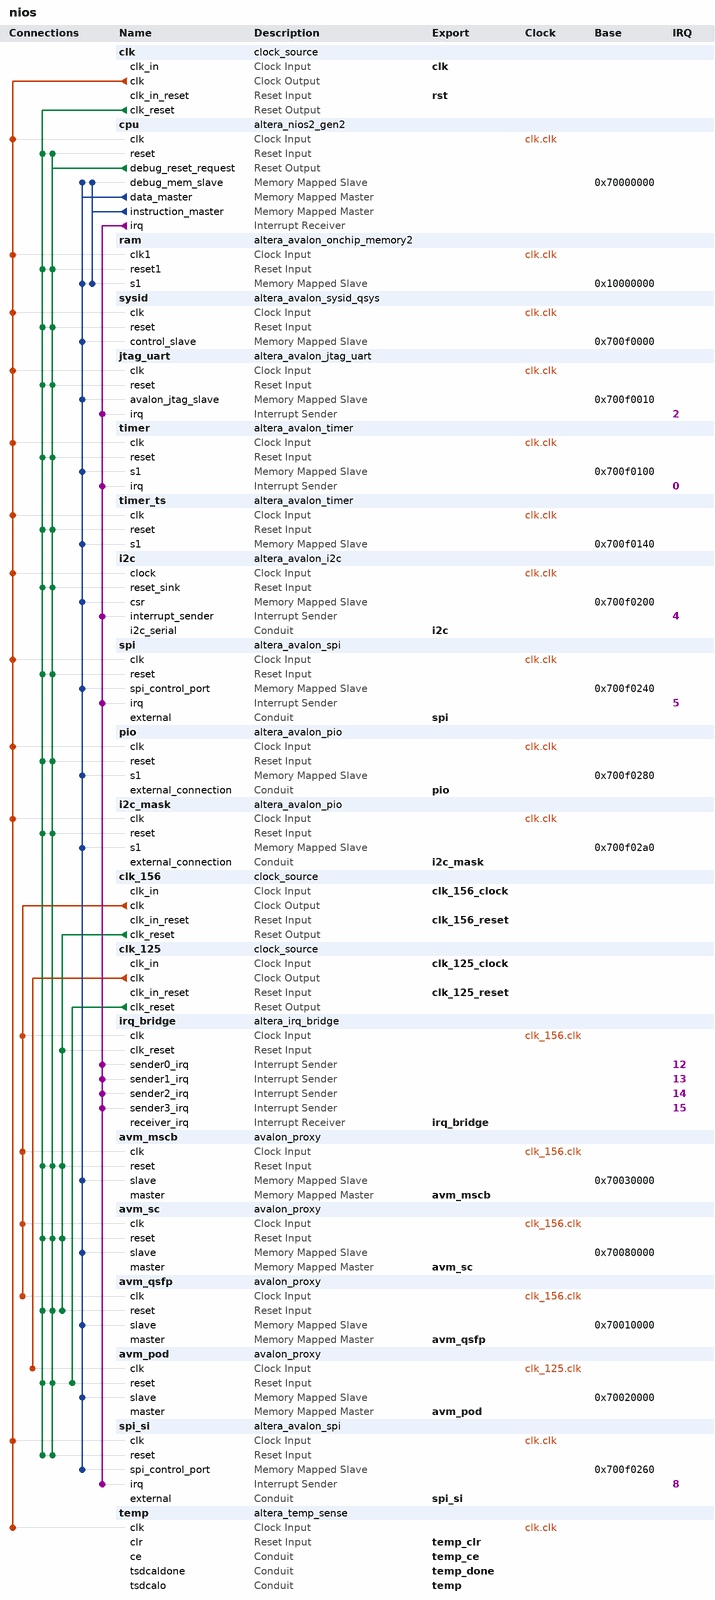
[diagram p0: system contents]
# Platform Designer (Qsys) system nios, Arria V 5AGXBA7D4F31C5
# Parameters at their usual value, and those the tool derives, are not listed.
package require -exact qsys 18.1
create_system nios
set_project_property DEVICE_FAMILY {Arria V}
set_project_property DEVICE 5AGXBA7D4F31C5

add_instance clk clock_source 18.1
set_instance_parameter_value clk clockFrequency 50000000
set_instance_parameter_value clk resetSynchronousEdges DEASSERT

add_instance cpu altera_nios2_gen2 18.1
set_instance_parameter_value cpu dcache_size 2048
set_instance_parameter_value cpu exceptionSlave ram.s1
set_instance_parameter_value cpu icache_size 4096
set_instance_parameter_value cpu impl Tiny
set_instance_parameter_value cpu io_regionbase 1879048192
set_instance_parameter_value cpu io_regionsize 268435456
set_instance_parameter_value cpu resetSlave ram.s1

add_instance ram altera_avalon_onchip_memory2 18.1
set_instance_parameter_value ram dataWidth 32
set_instance_parameter_value ram dualPort false
set_instance_parameter_value ram initMemContent true
set_instance_parameter_value ram initializationFileName output_files/nios_ram.hex
set_instance_parameter_value ram memorySize 131072
set_instance_parameter_value ram useNonDefaultInitFile true

add_instance sysid altera_avalon_sysid_qsys 18.1
set_instance_parameter_value sysid id 0

add_instance jtag_uart altera_avalon_jtag_uart 18.1
set_instance_parameter_value jtag_uart simInteractiveOptions NO_INTERACTIVE_WINDOWS

add_instance timer altera_avalon_timer 18.1
set_instance_parameter_value timer alwaysRun true
set_instance_parameter_value timer fixedPeriod true
set_instance_parameter_value timer period 1
set_instance_parameter_value timer periodUnits MSEC
set_instance_parameter_value timer snapshot false

add_instance timer_ts altera_avalon_timer 18.1
set_instance_parameter_value timer_ts period 1
set_instance_parameter_value timer_ts periodUnits MSEC

add_instance i2c altera_avalon_i2c 18.1
set_instance_parameter_value i2c FIFO_DEPTH 4

add_instance spi altera_avalon_spi 18.1
set_instance_parameter_value spi clockPolarity 0
set_instance_parameter_value spi dataWidth 8
set_instance_parameter_value spi masterSPI true
set_instance_parameter_value spi numberOfSlaves 16
set_instance_parameter_value spi targetClockRate 128000

add_instance pio altera_avalon_pio 18.1
set_instance_parameter_value pio bitModifyingOutReg true
set_instance_parameter_value pio direction Output
set_instance_parameter_value pio width 32

add_instance i2c_mask altera_avalon_pio 18.1
set_instance_parameter_value i2c_mask bitModifyingOutReg true
set_instance_parameter_value i2c_mask direction Output
set_instance_parameter_value i2c_mask width 32

add_instance clk_156 clock_source 18.1
set_instance_parameter_value clk_156 clockFrequency 156250000
set_instance_parameter_value clk_156 resetSynchronousEdges DEASSERT

add_instance clk_125 clock_source 18.1
set_instance_parameter_value clk_125 clockFrequency 125000000
set_instance_parameter_value clk_125 resetSynchronousEdges DEASSERT

add_instance irq_bridge altera_irq_bridge 18.1
set_instance_parameter_value irq_bridge IRQ_WIDTH 4

add_instance avm_mscb avalon_proxy 1.1
set_instance_parameter_value avm_mscb ADDRESS_UNITS 32
set_instance_parameter_value avm_mscb ADDRESS_WIDTH 4
set_instance_parameter_value avm_mscb DATA_WIDTH 32
set_instance_parameter_value avm_mscb READ_LATENCY 1
set_instance_parameter_value avm_mscb USE_READ_DATA_VALID false

add_instance avm_sc avalon_proxy 1.1
set_instance_parameter_value avm_sc ADDRESS_UNITS 32
set_instance_parameter_value avm_sc ADDRESS_WIDTH 16
set_instance_parameter_value avm_sc DATA_WIDTH 32
set_instance_parameter_value avm_sc READ_LATENCY 1
set_instance_parameter_value avm_sc USE_READ_DATA_VALID false

add_instance avm_qsfp avalon_proxy 1.1
set_instance_parameter_value avm_qsfp ADDRESS_UNITS 32
set_instance_parameter_value avm_qsfp ADDRESS_WIDTH 14
set_instance_parameter_value avm_qsfp DATA_WIDTH 32
set_instance_parameter_value avm_qsfp READ_LATENCY 0
set_instance_parameter_value avm_qsfp USE_READ_DATA_VALID false

add_instance avm_pod avalon_proxy 1.1
set_instance_parameter_value avm_pod ADDRESS_UNITS 32
set_instance_parameter_value avm_pod ADDRESS_WIDTH 14
set_instance_parameter_value avm_pod DATA_WIDTH 32
set_instance_parameter_value avm_pod READ_LATENCY 0
set_instance_parameter_value avm_pod USE_READ_DATA_VALID false

add_instance spi_si altera_avalon_spi 18.1
set_instance_parameter_value spi_si clockPolarity 0
set_instance_parameter_value spi_si dataWidth 8
set_instance_parameter_value spi_si masterSPI true
set_instance_parameter_value spi_si numberOfSlaves 2
set_instance_parameter_value spi_si targetClockRate 128000

add_instance temp altera_temp_sense 18.1
set_instance_parameter_value temp CBX_AUTO_BLACKBOX ALL
set_instance_parameter_value temp CE_CHECK true
set_instance_parameter_value temp CLK_FREQUENCY 50.0
set_instance_parameter_value temp CLOCK_DIVIDER_VALUE 80
set_instance_parameter_value temp CLR_CHECK true
set_instance_parameter_value temp NUMBER_OF_SAMPLES 128
set_instance_parameter_value temp POI_CAL_TEMPERATURE 85
set_instance_parameter_value temp SIM_TSDCALO 0
set_instance_parameter_value temp USER_OFFSET_ENABLE off
set_instance_parameter_value temp USE_WYS on

# connections
add_connection clk.clk cpu.clk clock
add_connection clk.clk i2c.clock clock
add_connection clk.clk i2c_mask.clk clock
add_connection clk.clk jtag_uart.clk clock
add_connection clk.clk pio.clk clock
add_connection clk.clk ram.clk1 clock
add_connection clk.clk spi.clk clock
add_connection clk.clk spi_si.clk clock
add_connection clk.clk sysid.clk clock
add_connection clk.clk temp.clk clock
add_connection clk.clk timer.clk clock
add_connection clk.clk timer_ts.clk clock
add_connection clk_125.clk avm_pod.clk clock
add_connection clk_156.clk avm_mscb.clk clock
add_connection clk_156.clk avm_qsfp.clk clock
add_connection clk_156.clk avm_sc.clk clock
add_connection clk_156.clk irq_bridge.clk clock
add_connection clk.clk_reset avm_mscb.reset reset
add_connection clk.clk_reset avm_pod.reset reset
add_connection clk.clk_reset avm_qsfp.reset reset
add_connection clk.clk_reset avm_sc.reset reset
add_connection clk.clk_reset cpu.reset reset
add_connection clk.clk_reset i2c.reset_sink reset
add_connection clk.clk_reset i2c_mask.reset reset
add_connection clk.clk_reset jtag_uart.reset reset
add_connection clk.clk_reset pio.reset reset
add_connection clk.clk_reset ram.reset1 reset
add_connection clk.clk_reset spi.reset reset
add_connection clk.clk_reset spi_si.reset reset
add_connection clk.clk_reset sysid.reset reset
add_connection clk.clk_reset timer.reset reset
add_connection clk.clk_reset timer_ts.reset reset
add_connection clk_125.clk_reset avm_pod.reset reset
add_connection clk_156.clk_reset avm_mscb.reset reset
add_connection clk_156.clk_reset avm_qsfp.reset reset
add_connection clk_156.clk_reset avm_sc.reset reset
add_connection clk_156.clk_reset irq_bridge.clk_reset reset
add_connection cpu.debug_reset_request avm_mscb.reset reset
add_connection cpu.debug_reset_request avm_pod.reset reset
add_connection cpu.debug_reset_request avm_qsfp.reset reset
add_connection cpu.debug_reset_request avm_sc.reset reset
add_connection cpu.debug_reset_request cpu.reset reset
add_connection cpu.debug_reset_request i2c.reset_sink reset
add_connection cpu.debug_reset_request i2c_mask.reset reset
add_connection cpu.debug_reset_request jtag_uart.reset reset
add_connection cpu.debug_reset_request pio.reset reset
add_connection cpu.debug_reset_request ram.reset1 reset
add_connection cpu.debug_reset_request spi.reset reset
add_connection cpu.debug_reset_request spi_si.reset reset
add_connection cpu.debug_reset_request sysid.reset reset
add_connection cpu.debug_reset_request timer.reset reset
add_connection cpu.debug_reset_request timer_ts.reset reset
add_connection cpu.data_master avm_mscb.slave avalon
set_connection_parameter_value cpu.data_master/avm_mscb.slave baseAddress 0x70030000
add_connection cpu.data_master avm_pod.slave avalon
set_connection_parameter_value cpu.data_master/avm_pod.slave baseAddress 0x70020000
add_connection cpu.data_master avm_qsfp.slave avalon
set_connection_parameter_value cpu.data_master/avm_qsfp.slave baseAddress 0x70010000
add_connection cpu.data_master avm_sc.slave avalon
set_connection_parameter_value cpu.data_master/avm_sc.slave baseAddress 0x70080000
add_connection cpu.data_master cpu.debug_mem_slave avalon
set_connection_parameter_value cpu.data_master/cpu.debug_mem_slave baseAddress 0x70000000
add_connection cpu.data_master i2c.csr avalon
set_connection_parameter_value cpu.data_master/i2c.csr baseAddress 0x700f0200
add_connection cpu.data_master i2c_mask.s1 avalon
set_connection_parameter_value cpu.data_master/i2c_mask.s1 baseAddress 0x700f02a0
add_connection cpu.data_master jtag_uart.avalon_jtag_slave avalon
set_connection_parameter_value cpu.data_master/jtag_uart.avalon_jtag_slave baseAddress 0x700f0010
add_connection cpu.data_master pio.s1 avalon
set_connection_parameter_value cpu.data_master/pio.s1 baseAddress 0x700f0280
add_connection cpu.data_master ram.s1 avalon
set_connection_parameter_value cpu.data_master/ram.s1 baseAddress 0x10000000
add_connection cpu.data_master spi.spi_control_port avalon
set_connection_parameter_value cpu.data_master/spi.spi_control_port baseAddress 0x700f0240
add_connection cpu.data_master spi_si.spi_control_port avalon
set_connection_parameter_value cpu.data_master/spi_si.spi_control_port baseAddress 0x700f0260
add_connection cpu.data_master sysid.control_slave avalon
set_connection_parameter_value cpu.data_master/sysid.control_slave baseAddress 0x700f0000
add_connection cpu.data_master timer.s1 avalon
set_connection_parameter_value cpu.data_master/timer.s1 baseAddress 0x700f0100
add_connection cpu.data_master timer_ts.s1 avalon
set_connection_parameter_value cpu.data_master/timer_ts.s1 baseAddress 0x700f0140
add_connection cpu.instruction_master cpu.debug_mem_slave avalon
set_connection_parameter_value cpu.instruction_master/cpu.debug_mem_slave baseAddress 0x70000000
add_connection cpu.instruction_master ram.s1 avalon
set_connection_parameter_value cpu.instruction_master/ram.s1 baseAddress 0x10000000
add_connection cpu.irq i2c.interrupt_sender interrupt
set_connection_parameter_value cpu.irq/i2c.interrupt_sender irqNumber 4
add_connection cpu.irq irq_bridge.sender0_irq interrupt
set_connection_parameter_value cpu.irq/irq_bridge.sender0_irq irqNumber 12
add_connection cpu.irq irq_bridge.sender1_irq interrupt
set_connection_parameter_value cpu.irq/irq_bridge.sender1_irq irqNumber 13
add_connection cpu.irq irq_bridge.sender2_irq interrupt
set_connection_parameter_value cpu.irq/irq_bridge.sender2_irq irqNumber 14
add_connection cpu.irq irq_bridge.sender3_irq interrupt
set_connection_parameter_value cpu.irq/irq_bridge.sender3_irq irqNumber 15
add_connection cpu.irq jtag_uart.irq interrupt
set_connection_parameter_value cpu.irq/jtag_uart.irq irqNumber 2
add_connection cpu.irq spi.irq interrupt
set_connection_parameter_value cpu.irq/spi.irq irqNumber 5
add_connection cpu.irq spi_si.irq interrupt
set_connection_parameter_value cpu.irq/spi_si.irq irqNumber 8
add_connection cpu.irq timer.irq interrupt
set_connection_parameter_value cpu.irq/timer.irq irqNumber 0

# exported interfaces
add_interface avm_mscb avalon master
set_interface_property avm_mscb EXPORT_OF avm_mscb.master
add_interface avm_pod avalon master
set_interface_property avm_pod EXPORT_OF avm_pod.master
add_interface avm_qsfp avalon master
set_interface_property avm_qsfp EXPORT_OF avm_qsfp.master
add_interface avm_sc avalon master
set_interface_property avm_sc EXPORT_OF avm_sc.master
add_interface clk clock sink
set_interface_property clk EXPORT_OF clk.clk_in
add_interface clk_125_clock clock sink
set_interface_property clk_125_clock EXPORT_OF clk_125.clk_in
add_interface clk_125_reset reset sink
set_interface_property clk_125_reset EXPORT_OF clk_125.clk_in_reset
add_interface clk_156_clock clock sink
set_interface_property clk_156_clock EXPORT_OF clk_156.clk_in
add_interface clk_156_reset reset sink
set_interface_property clk_156_reset EXPORT_OF clk_156.clk_in_reset
add_interface i2c conduit end
set_interface_property i2c EXPORT_OF i2c.i2c_serial
add_interface i2c_mask conduit end
set_interface_property i2c_mask EXPORT_OF i2c_mask.external_connection
add_interface irq_bridge interrupt receiver
set_interface_property irq_bridge EXPORT_OF irq_bridge.receiver_irq
add_interface pio conduit end
set_interface_property pio EXPORT_OF pio.external_connection
add_interface rst reset sink
set_interface_property rst EXPORT_OF clk.clk_in_reset
add_interface spi conduit end
set_interface_property spi EXPORT_OF spi.external
add_interface spi_si conduit end
set_interface_property spi_si EXPORT_OF spi_si.external
add_interface temp conduit end
set_interface_property temp EXPORT_OF temp.tsdcalo
add_interface temp_ce conduit end
set_interface_property temp_ce EXPORT_OF temp.ce
add_interface temp_clr reset sink
set_interface_property temp_clr EXPORT_OF temp.clr
add_interface temp_done conduit end
set_interface_property temp_done EXPORT_OF temp.tsdcaldone

set_interconnect_requirement {$system} qsys_mm.clockCrossingAdapter HANDSHAKE
set_interconnect_requirement {$system} qsys_mm.enableEccProtection FALSE
set_interconnect_requirement {$system} qsys_mm.insertDefaultSlave FALSE
set_interconnect_requirement {$system} qsys_mm.maxAdditionalLatency 1

save_system nios.qsys
